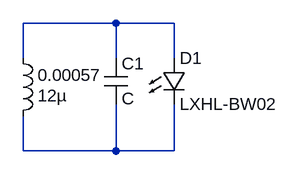
[diagram p0: schematic Draft1_WPT.asc]
Draft1_WPT.asc, the LTspice schematic file:
Version 4
SHEET 1 880 680
WIRE 224 80 96 80
WIRE 304 80 224 80
WIRE 96 128 96 80
WIRE 224 128 224 80
WIRE 304 128 304 80
WIRE 96 256 96 208
WIRE 224 256 224 192
WIRE 224 256 96 256
WIRE 304 256 304 192
WIRE 304 256 224 256
SYMBOL cap 208 128 R0
SYMATTR InstName C1
SYMBOL ind 80 112 R0
WINDOW 3 36 68 Left 2
SYMATTR InstName 0.00057
SYMATTR Value 12µ
SYMATTR SpiceLine Ipk=1.3 Rser=0.146 Rpar=21780 Cpar=1.591p mfg="Bourns, Inc." pn="SDE0403A-120M"
SYMBOL LED 288 128 R0
SYMATTR InstName D1
SYMATTR Value LXHL-BW02

The netlist it stands for:
* Draft1_WPT.asc
C1 N001 N002 C
L§0.00057 N001 N002 12µ Ipk=1.3 Rser=0.146 Rpar=21780 Cpar=1.591p mfg="Bourns, Inc." pn="SDE0403A-120M"
D1 N001 N002 LXHL-BW02
.model D D
.lib standard.dio
.backanno
.end